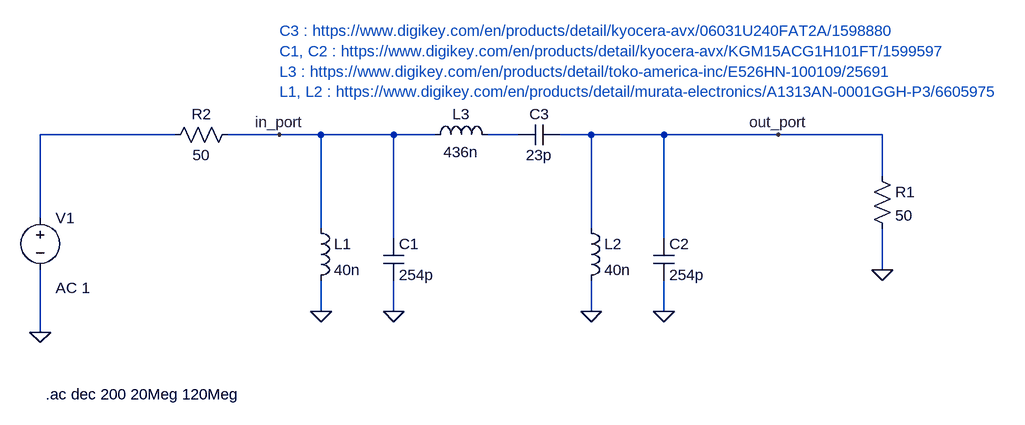
[diagram p0: schematic 49500khz_bandpass_10mhz.asc]
49500khz_bandpass_10mhz.asc, the LTspice schematic file:
Version 4.1
SHEET 1 1360 680
WIRE -64 -64 -272 -64
WIRE 96 -64 16 -64
WIRE 160 -64 96 -64
WIRE 272 -64 160 -64
WIRE 336 -64 272 -64
WIRE 464 -64 416 -64
WIRE 576 -64 528 -64
WIRE 688 -64 576 -64
WIRE 864 -64 688 -64
WIRE 1024 -64 864 -64
WIRE 1024 0 1024 -64
WIRE -272 64 -272 -64
WIRE 160 80 160 -64
WIRE 576 80 576 -64
WIRE 272 96 272 -64
WIRE 688 96 688 -64
WIRE 1024 144 1024 80
WIRE 160 208 160 160
WIRE 272 208 272 160
WIRE 576 208 576 160
WIRE 688 208 688 160
WIRE -272 240 -272 144
FLAG 688 208 0
FLAG 576 208 0
FLAG 272 208 0
FLAG 160 208 0
FLAG 1024 144 0
FLAG -272 240 0
FLAG 96 -64 in_port
FLAG 864 -64 out_port
SYMBOL ind 144 64 R0
SYMATTR InstName L1
SYMATTR Value 40n
SYMBOL ind 560 64 R0
SYMATTR InstName L2
SYMATTR Value 40n
SYMBOL cap 256 96 R0
SYMATTR InstName C1
SYMATTR Value 254p
SYMBOL cap 672 96 R0
SYMATTR InstName C2
SYMATTR Value 254p
SYMBOL cap 528 -80 R90
WINDOW 0 0 32 VBottom 2
WINDOW 3 32 32 VTop 2
SYMATTR InstName C3
SYMATTR Value 23p
SYMBOL ind 320 -48 R270
WINDOW 0 32 56 VTop 2
WINDOW 3 5 56 VBottom 2
SYMATTR InstName L3
SYMATTR Value 436n
SYMBOL res 1008 -16 R0
SYMATTR InstName R1
SYMATTR Value 50
SYMBOL res 32 -80 R90
WINDOW 0 0 56 VBottom 2
WINDOW 3 32 56 VTop 2
SYMATTR InstName R2
SYMATTR Value 50
SYMBOL voltage -272 48 R0
WINDOW 123 24 124 Left 2
WINDOW 39 0 0 Left 0
SYMATTR Value2 AC 1
SYMATTR InstName V1
SYMATTR Value ""
TEXT -264 336 Left 2 !.ac dec 200 20Meg 120Meg
TEXT 96 -224 Left 2 ;C3 : https://www.digikey.com/en/products/detail/kyocera-avx/06031U240FAT2A/1598880\nC1, C2 : https://www.digikey.com/en/products/detail/kyocera-avx/KGM15ACG1H101FT/1599597\nL3 : https://www.digikey.com/en/products/detail/toko-america-inc/E526HN-100109/25691\nL1, L2 : https://www.digikey.com/en/products/detail/murata-electronics/A1313AN-0001GGH-P3/6605975

The netlist it stands for:
* 49500khz_bandpass_10mhz.asc
L1 in_port 0 40n
L2 out_port 0 40n
C1 in_port 0 254p
C2 out_port 0 254p
C3 out_port N002 23p
L3 in_port N002 436n
R1 out_port 0 50
R2 in_port N001 50
V1 N001 0 AC 1
.ac dec 200 20Meg 120Meg
* C3 : https://www.digikey.com/en/products/detail/kyocera-avx/06031U240FAT2A/1598880
* C1, C2 : https://www.digikey.com/en/products/detail/kyocera-avx/KGM15ACG1H101FT/1599597
* L3 : https://www.digikey.com/en/products/detail/toko-america-inc/E526HN-100109/25691
* L1, L2 : https://www.digikey.com/en/products/detail/murata-electronics/A1313AN-0001GGH-P3/6605975
.backanno
.end